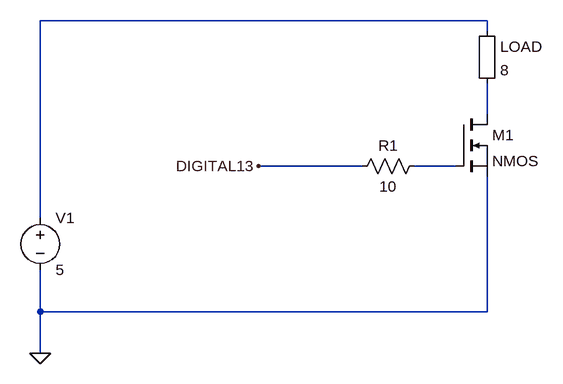
[diagram p0: schematic Low side NFET.asc]
Low side NFET.asc, the LTspice schematic file:
Version 4
SHEET 1 880 680
WIRE 768 32 80 32
WIRE 768 48 768 32
WIRE 768 176 768 128
WIRE 576 256 416 256
WIRE 720 256 656 256
WIRE 80 336 80 32
WIRE 80 480 80 416
WIRE 768 480 768 272
WIRE 768 480 80 480
WIRE 80 544 80 480
FLAG 80 544 0
FLAG 416 256 DIGITAL13
SYMBOL voltage 80 320 R0
SYMATTR InstName V1
SYMATTR Value 5
SYMBOL Misc/EuropeanResistor 752 32 R0
SYMATTR InstName LOAD
SYMATTR Value 8
SYMBOL nmos 720 176 R0
SYMATTR InstName M1
SYMBOL res 672 240 R90
WINDOW 0 0 56 VBottom 2
WINDOW 3 32 56 VTop 2
SYMATTR InstName R1
SYMATTR Value 10

The netlist it stands for:
* Low side NFET.asc
V1 N001 0 5
R§LOAD N001 N002 8
M1 N002 N003 0 0 NMOS
R1 N003 DIGITAL13 10
.model NMOS NMOS
.model PMOS PMOS
.lib standard.mos
.backanno
.end